# EAGLE schematic tunnelAmp (EAGLE 6.4)
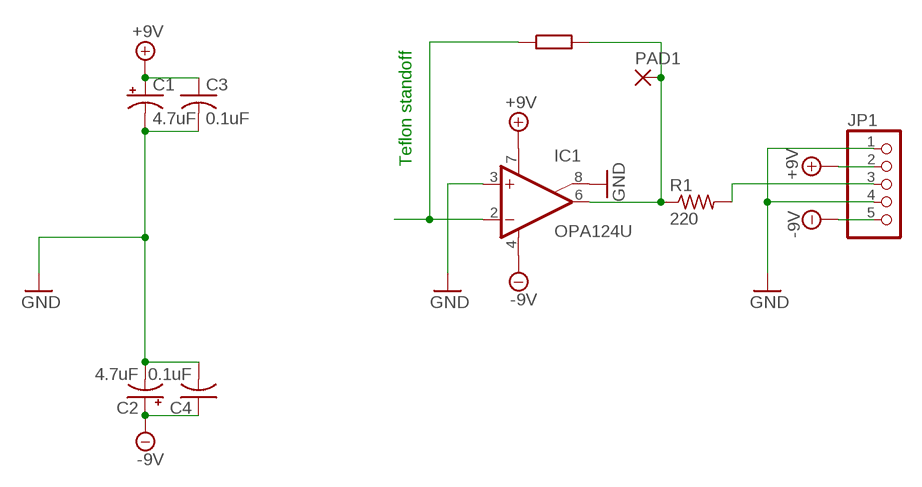
[diagram p0: schematic, sheet 1]

## Parts
C1  4.7uF  CPOL-USC/6032-28W  [C/6032-28W]
C2  4.7uF  CPOL-USC/6032-28W  [C/6032-28W]
C3  0.1uF  C-USC0603  [C0603]
C4  0.1uF  C-USC0603  [C0603]
IC1  OPA124U  [SO08]
JP1  PINHD-1X5  [1X05]
PAD1  1,6/0,9  [1,6/0,9]
R1  220  R-US_R0603  [R0603]

## Nets
+9V: C1.+ C3.1 IC1.7(V+) JP1.2
-9V: C2.+ C4.1 IC1.4(V-) JP1.5
GND: C1.- C2.- C3.2 C4.2 IC1.3(+IN) IC1.8(SUBS) JP1.1 JP1.4
N$1: IC1.6(OUT) PAD1.1(P) R1.1
N$2: JP1.3 R1.2
N$4: IC1.2(-IN)

## Notes on the sheet
- Teflon standoff

## Library data of the parts
C1 C2 = resistor:CPOL-US: POLARIZED CAPACITOR, American symbol
C3 C4 = resistor:C-US: CAPACITOR, American symbol
IC1 = burr-brown:OPA124U: Difet Operational Amplifier
JP1 = pinhead:PINHD-1X5: PIN HEADER
PAD1 = wirepad:1,6/0,9: THROUGH-HOLE PAD
R1 = resistor:R-US_: RESISTOR, American symbol